# Altium schematic sheet Guide_laser.SchDoc
size 420 x 297 mm; Address1: Address1; Address2: Address2; Address3: Address3; Address4: Address4; DocumentNumber: *Э3; SheetNumber: 4; SheetTotal: 15; DocumentType: Схема электрическая *
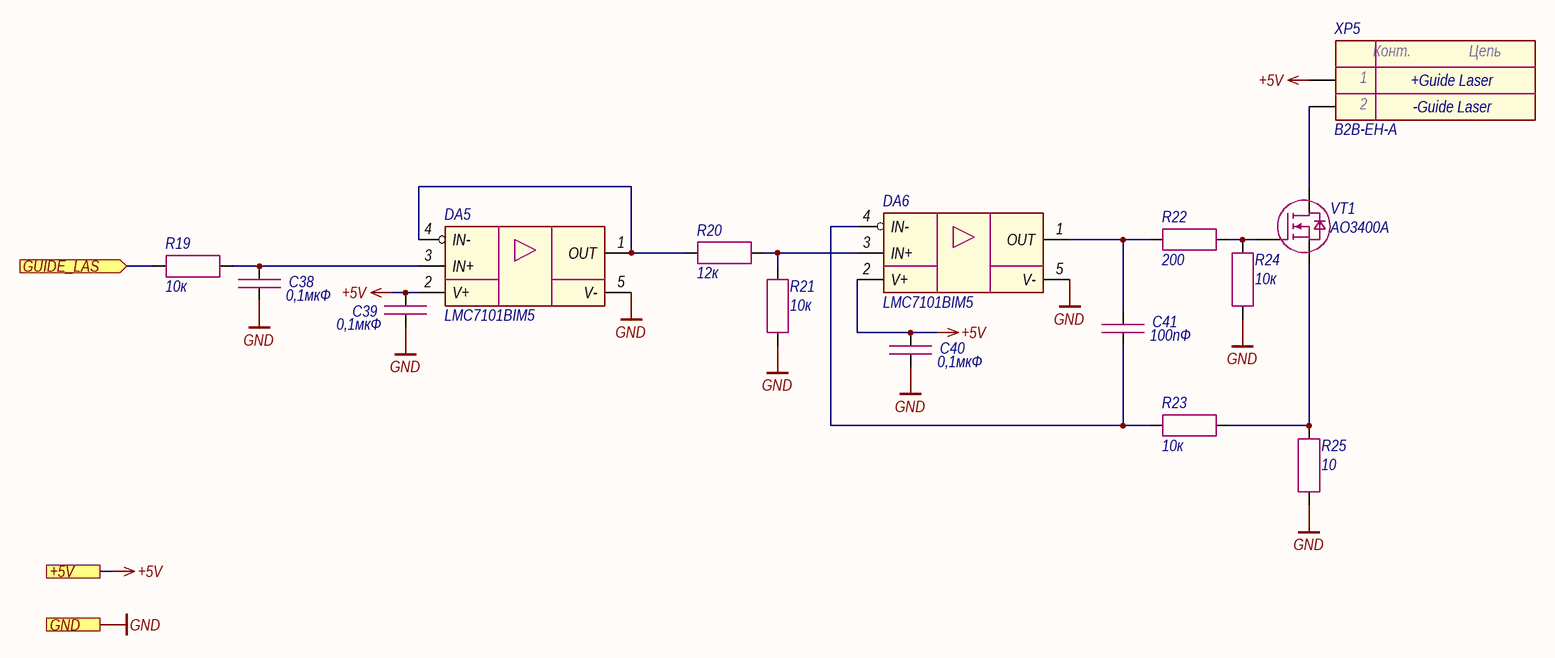
[diagram p0: Guide_laser.SchDoc]

## Parts
C38  0,1мкФ  [CAP_0603]
C39  0,1мкФ  [CAP_0603]
C40  0,1мкФ  [CAP_0603]
C41  100пФ  [CAP_0603]
DA5  LMC7101BIM5  [SOT-23-5]
DA6  LMC7101BIM5  [SOT-23-5]
R19  10к  [RES_0603]
R20  12к  [RES_0603]
R21  10к  [RES_0603]
R22  200  [RES_0603]
R23  10к  [RES_0603]
R24  10к  [RES_0603]
R25  10  [RES_1210]
VT1  AO3400A  [SOT-23-3]
XP5  B2B-EH-A  [B2B-EH-A]

## Ports
+5V (see Main[1C]), GND (see Main[1C], Button[1D], Column[1C], Ethernet[3D], Fiber_interlock[2C], Flow_sensor[2C], Hardwiring[3D], Indication[1C], LD_driver[1D], Power_supply[1D], Power_supply_CAN[1D], SF_driver[2D]), GUIDE_LAS (in, see Main[2C])

## Nets
+5V: C39.1 C40.1 DA5.2(V+) DA6.2(V+) XP5.1 ; port +5V
GND: C38.2 C39.2 C40.2 DA5.5(V-) DA6.5(V-) R21.2 R24.1 R25.1 ; port GND
GUIDE_LAS: R19.1 ; port GUIDE_LAS
NetC38_1: C38.1 DA5.3(IN+) R19.2
NetC41_1: C41.1 DA6.1(OUT) R22.1
NetC41_2: C41.2 DA6.4(IN-) R23.1
NetDA5_1: DA5.1(OUT) DA5.4(IN-) R20.1
NetDA6_3: DA6.3(IN+) R20.2 R21.1
NetR22_2: R22.2 R24.2 VT1.1(G)
NetR23_2: R23.2 R25.2 VT1.2(S)
NetVT1_3: VT1.3(D) XP5.2

## Notes on the sheet
- +Guide Laser
- -Guide Laser
- Подп. и дата
- Инв. № дубл.
- Взам. инв. №
- Инв. № подл.
- Изм.
- Лист
- № докум.
- Подп.
- Дата
- Копировал
- Формат А3
- (in symbol Connector-2) Конт.; Цепь

## Library data of the parts
C38-C40 = Capacitor: Manufacturer: Murata; Model: GRM188R71H104KA93D; Value: 0,1мкФ; Document: *
C41 = Capacitor: Manufacturer: Murata; Model: GRM1885C1H101JA01D; Value: 100пФ; Document: *
DA5 DA6 = LMC7101: Manufacturer: Texas Instruments; Model: LMC7101BIM5; Document: *
R19 R21 R23 R24 = Resistor: Manufacturer: Yageo; Model: RC0603FR-0710KL; Value: 10к; Document: *
R20 = Resistor: Manufacturer: Yageo; Model: RC0603FR-0712KL; Value: 12к; Document: *
R22 = Resistor: Manufacturer: Yageo; Model: RC0603FR-07200RL; Value: 200; Document: *
R25 = Resistor: Manufacturer: Yageo; Model: RC1210FR-0710RL; Value: 10; Document: *
VT1 = MOSFET N-channel: Manufacturer: UMW; Model: AO3400A; Document: *
XP5 = Connector-2: Manufacturer: JST; Model: B2B-EH-A; Document: *